# Altium schematic sheet IR_Remote_Keypad.SchDoc
size A4; Revision: 2.0; SheetNumber: 2; SheetTotal: 2
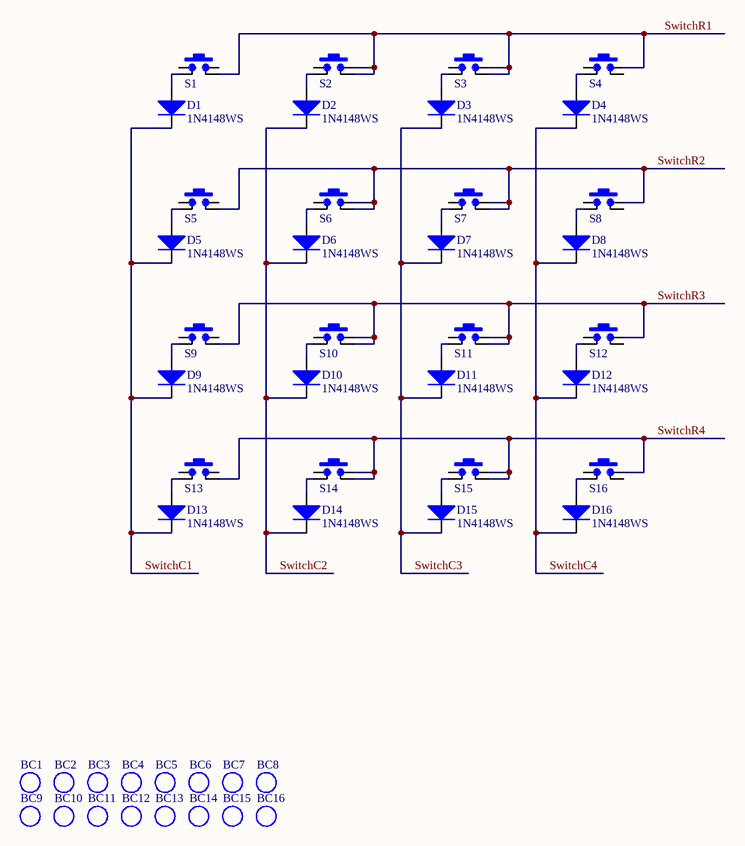
[diagram p0: IR_Remote_Keypad.SchDoc]

## Parts
BC1  Button cap  [Button-cap-with-skirt]  (value not drawn)
BC2  Button cap  [Button-cap-with-skirt]  (value not drawn)
BC3  Button cap  [Button-cap-with-skirt]  (value not drawn)
BC4  Button cap  [Button-cap-with-skirt]  (value not drawn)
BC5  Button cap  [Button-cap-with-skirt]  (value not drawn)
BC6  Button cap  [Button-cap-with-skirt]  (value not drawn)
BC7  Button cap  [Button-cap-with-skirt]  (value not drawn)
BC8  Button cap  [Button-cap-with-skirt]  (value not drawn)
BC9  Button cap  [Button-cap-with-skirt]  (value not drawn)
BC10  Button cap  [Button-cap-with-skirt]  (value not drawn)
BC11  Button cap  [Button-cap-with-skirt]  (value not drawn)
BC12  Button cap  [Button-cap-with-skirt]  (value not drawn)
BC13  Button cap  [Button-cap-with-skirt]  (value not drawn)
BC14  Button cap  [Button-cap-with-skirt]  (value not drawn)
BC15  Button cap  [Button-cap-with-skirt]  (value not drawn)
BC16  Button cap  [Button-cap-with-skirt]  (value not drawn)
D1  1N4148WS  [SOD-323]
D2  1N4148WS  [SOD-323]
D3  1N4148WS  [SOD-323]
D4  1N4148WS  [SOD-323]
D5  1N4148WS  [SOD-323]
D6  1N4148WS  [SOD-323]
D7  1N4148WS  [SOD-323]
D8  1N4148WS  [SOD-323]
D9  1N4148WS  [SOD-323]
D10  1N4148WS  [SOD-323]
D11  1N4148WS  [SOD-323]
D12  1N4148WS  [SOD-323]
D13  1N4148WS  [SOD-323]
D14  1N4148WS  [SOD-323]
D15  1N4148WS  [SOD-323]
D16  1N4148WS  [SOD-323]
S1  SW_SMT_14mm  [SW_SMT_14mm]  (value not drawn)
S2  SW_SMT_14mm  [SW_SMT_14mm]  (value not drawn)
S3  SW_SMT_14mm  [SW_SMT_14mm]  (value not drawn)
S4  SW_SMT_14mm  [SW_SMT_14mm]  (value not drawn)
S5  SW_SMT_14mm  [SW_SMT_14mm]  (value not drawn)
S6  SW_SMT_14mm  [SW_SMT_14mm]  (value not drawn)
S7  SW_SMT_14mm  [SW_SMT_14mm]  (value not drawn)
S8  SW_SMT_14mm  [SW_SMT_14mm]  (value not drawn)
S9  SW_SMT_14mm  [SW_SMT_14mm]  (value not drawn)
S10  SW_SMT_14mm  [SW_SMT_14mm]  (value not drawn)
S11  SW_SMT_14mm  [SW_SMT_14mm]  (value not drawn)
S12  SW_SMT_14mm  [SW_SMT_14mm]  (value not drawn)
S13  SW_SMT_14mm  [SW_SMT_14mm]  (value not drawn)
S14  SW_SMT_14mm  [SW_SMT_14mm]  (value not drawn)
S15  SW_SMT_14mm  [SW_SMT_14mm]  (value not drawn)
S16  SW_SMT_14mm  [SW_SMT_14mm]  (value not drawn)

## Nets
SwitchC1: D1.K D5.K D9.K D13.K
SwitchC2: D2.K D6.K D10.K D14.K
SwitchC3: D3.K D7.K D11.K D15.K
SwitchC4: D4.K D8.K D12.K D16.K
SwitchR1: S1.2 S2.2 S2.2b S3.2 S3.2b S4.2b
SwitchR2: S5.1 S6.1 S6.1b S7.1 S7.1b S8.1b
SwitchR3: S9.1 S10.1 S10.1b S11.1 S11.1b S12.1b
SwitchR4: S13.1 S14.1 S14.1b S15.1 S15.1b S16.1b
NetD1_A: D1.A S1.1
NetD2_A: D2.A S2.1
NetD3_A: D3.A S3.1
NetD4_A: D4.A S4.1
NetD5_A: D5.A S5.2
NetD6_A: D6.A S6.2
NetD7_A: D7.A S7.2
NetD8_A: D8.A S8.2
NetD9_A: D9.A S9.2
NetD10_A: D10.A S10.2
NetD11_A: D11.A S11.2
NetD12_A: D12.A S12.2
NetD13_A: D13.A S13.2
NetD14_A: D14.A S14.2
NetD15_A: D15.A S15.2
NetD16_A: D16.A S16.2

Not connected (* = marked no-connect by the designer): S1 1b 2b; S2 1b; S3 1b; S4 1b 2; S5 1b 2b; S6 2b; S7 2b; S8 1 2b; S9 1b 2b; S10 2b; S11 2b; S12 1 2b; S13 1b 2b; S14 2b; S15 2b; S16 1 2b

## Library data of the parts
BC1-BC16 = Small Button Cap: 6.2mm x 6mm (WxH) button cap
D1-D16 = 1N4148WS: Diode - Switching 100V 150mA 1.25V@150mA 4ns SOD-323; Class: Discrete; SubClass: Diode - Switching; Digikey: *; Farnell PN: 2889105; LCSC: C2128
S1-S16 = SW_PB_SMT: SMT Switch gull-wing leads common; Revision: 1.0; LCSC: C318888